# Altium schematic sheet Top.SchDoc
size A4
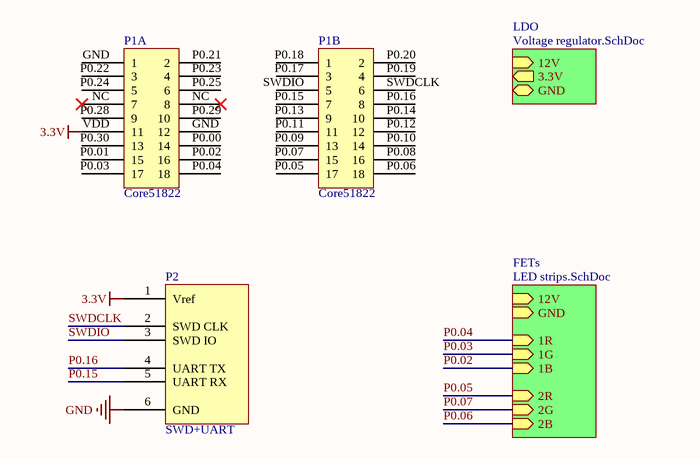
[diagram p0: Top.SchDoc]

## Parts
P1  Core51822  (parts A,B of 2)
P2  SWD+UART

## Sub-sheets
FETs = LED strips.SchDoc: 1B (in), 12V (in), 2R (in), 1R (in), 2G (in), 1G (in), 2B (in), GND (in)
LDO = Voltage regulator.SchDoc: 3.3V (out), 12V (in), GND (bidir)

## Nets
3.3V: P1.VDD(11) P2.1(Vref)
GND: P2.6(GND)
P0.02: sheet FETs/1B
P0.03: sheet FETs/1G
P0.04: sheet FETs/1R
P0.05: sheet FETs/2R
P0.06: sheet FETs/2B
P0.07: sheet FETs/2G
P0.15: P2.5(UART_RX)
P0.16: P2.4(UART_TX)
SWDCLK: P2.2(SWD_CLK)
SWDIO: P2.3(SWD_IO)

Not connected (* = marked no-connect by the designer): P1 GND(1) NC(7)* P0.00(14) P0.01(15) P0.02(16) P0.03(17) P0.04(18) P0.05(17) P0.06(18) P0.07(15) P0.08(16) P0.09(13) P0.10(14) P0.11(11) P0.12(12) P0.13(9) P0.14(10) P0.15(7) P0.16(8) P0.17(3) P0.18(1) P0.19(4) P0.20(2) P0.21(2) P0.22(3) P0.23(4) P0.24(5) P0.25(6) P0.28(9) P0.29(10) P0.30(13) SWDCLK(6) SWDIO(5)